# Altium schematic sheet STC32G12K128.SchDoc
size A3; SheetNumber: 1; SheetTotal: 1
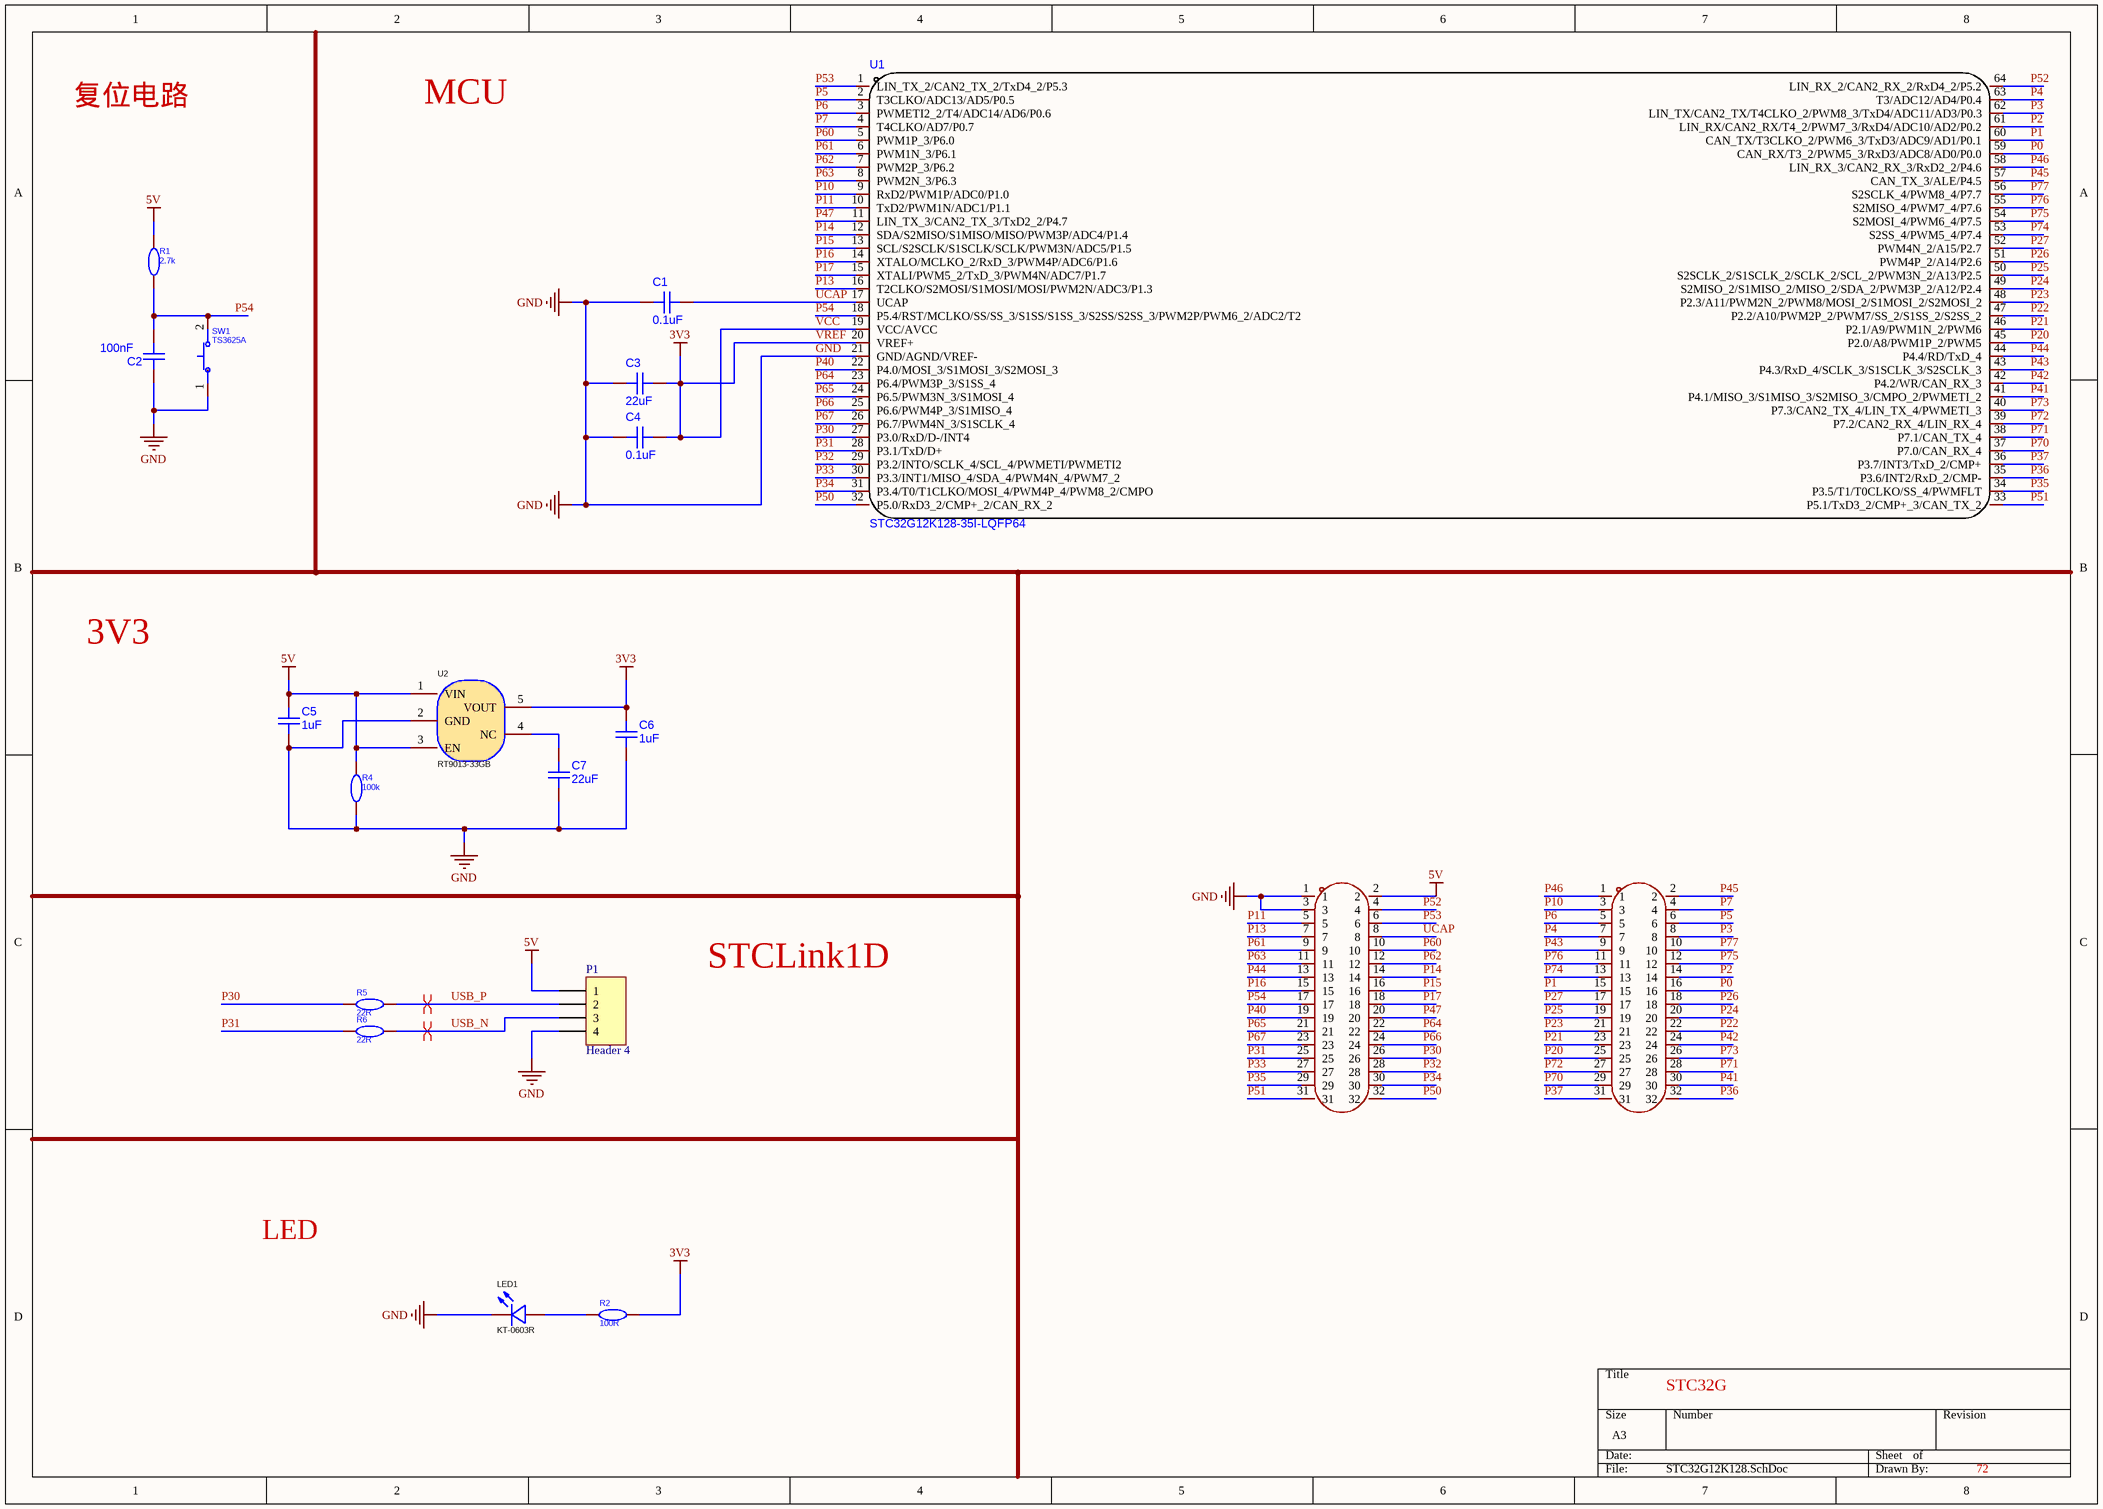
[diagram p0: STC32G12K128.SchDoc]

## Parts
C1  0.1uF  [C0603]
C2  100nF  [C0603]
C3  22uF  [C0603]
C4  0.1uF  [C0603]
C5  1uF  [C0603]
C6  1uF  [C0603]
C7  22uF  [C0603]
H1  X6521WV-2x16H-C60D30  [HDR-TH_32P-2.54-V-M-R2-C16-S2.54]  (value not drawn)
H2  X6521WV-2x16H-C60D30  [HDR-TH_32P-2.54-V-M-R2-C16-S2.54]  (value not drawn)
LED1  KT-0603R  [LED0603-RD]
P1  Header 4  [HDR1X4]
R1  2.7k  [R0603]
R2  100R  [R0603]
R4  100k  [R0603]
R5  22R  [R0603]
R6  22R  [R0603]
SW1  TS3625A  [KEY-SMD_L6.0-W3.5-LS8.4]
U1  STC32G12K128-35I-LQFP64  [LQFP-64_L10.0-W10.0-P0.50-LS12.0-BL]
U2  RT9013-33GB  [SOT-23-5_L3.0-W1.7-P0.95-LS2.8-BL]

## Nets
5V: C5.1 H2.2 P1.1 R1.2 R4.2 U2.1(VIN) U2.3(EN)
GND: C1.2 C2.1 C3.2 C4.2 C5.2 C6.2 C7.2 H2.1 H2.3 LED1.1(K) P1.4 R4.1 SW1.1 U1.21(GND/AGND/VREF-) U2.2(GND)
VCC: C3.1 C4.1 C6.1 R2.1 U1.19(VCC/AVCC) U1.20(VREF+) U2.5(VOUT)  [also labelled 3V3, VREF]
P0: H1.16 U1.59(CAN_RX/T3_2/PWM5_3/RxD3/ADC8/AD0/P0.0)
P1: H1.15 U1.60(CAN_TX/T3CLKO_2/PWM6_3/TxD3/ADC9/AD1/P0.1)
P2: H1.14 U1.61(LIN_RX/CAN2_RX/T4_2/PWM7_3/RxD4/ADC10/AD2/P0.2)
P3: H1.8 U1.62(LIN_TX/CAN2_TX/T4CLKO_2/PWM8_3/TxD4/ADC11/AD3/P0.3)
P4: H1.7 U1.63(T3/ADC12/AD4/P0.4)
P5: H1.6 U1.2(T3CLKO/ADC13/AD5/P0.5)
P6: H1.5 U1.3(PWMETI2_2/T4/ADC14/AD6/P0.6)
P7: H1.4 U1.4(T4CLKO/AD7/P0.7)
P10: H1.3 U1.9(RxD2/PWM1P/ADC0/P1.0)
P11: H2.5 U1.10(TxD2/PWM1N/ADC1/P1.1)
P13: H2.7 U1.16(T2CLKO/S2MOSI/S1MOSI/MOSI/PWM2N/ADC3/P1.3)
P14: H2.14 U1.12(SDA/S2MISO/S1MISO/MISO/PWM3P/ADC4/P1.4)
P15: H2.16 U1.13(SCL/S2SCLK/S1SCLK/SCLK/PWM3N/ADC5/P1.5)
P16: H2.15 U1.14(XTALO/MCLKO_2/RxD_3/PWM4P/ADC6/P1.6)
P17: H2.18 U1.15(XTALI/PWM5_2/TxD_3/PWM4N/ADC7/P1.7)
P20: H1.25 U1.45(P2.0/A8/PWM1P_2/PWM5)
P21: H1.23 U1.46(P2.1/A9/PWM1N_2/PWM6)
P22: H1.22 U1.47(P2.2/A10/PWM2P_2/PWM7/SS_2/S1SS_2/S2SS_2)
P23: H1.21 U1.48(P2.3/A11/PWM2N_2/PWM8/MOSI_2/S1MOSI_2/S2MOSI_2)
P24: H1.20 U1.49(S2MISO_2/S1MISO_2/MISO_2/SDA_2/PWM3P_2/A12/P2.4)
P25: H1.19 U1.50(S2SCLK_2/S1SCLK_2/SCLK_2/SCL_2/PWM3N_2/A13/P2.5)
P26: H1.18 U1.51(PWM4P_2/A14/P2.6)
P27: H1.17 U1.52(PWM4N_2/A15/P2.7)
P30: H2.26 R5.2 U1.27(P3.0/RxD/D-/INT4)
P31: H2.25 R6.2 U1.28(P3.1/TxD/D+)
P32: H2.28 U1.29(P3.2/INTO/SCLK_4/SCL_4/PWMETI/PWMETI2)
P33: H2.27 U1.30(P3.3/INT1/MISO_4/SDA_4/PWM4N_4/PWM7_2)
P34: H2.30 U1.31(P3.4/T0/T1CLKO/MOSI_4/PWM4P_4/PWM8_2/CMPO)
P35: H2.29 U1.34(P3.5/T1/T0CLKO/SS_4/PWMFLT)
P36: H1.32 U1.35(P3.6/INT2/RxD_2/CMP-)
P37: H1.31 U1.36(P3.7/INT3/TxD_2/CMP+)
P40: H2.19 U1.22(P4.0/MOSI_3/S1MOSI_3/S2MOSI_3)
P41: H1.30 U1.41(P4.1/MISO_3/S1MISO_3/S2MISO_3/CMPO_2/PWMETI_2)
P42: H1.24 U1.42(P4.2/WR/CAN_RX_3)
P43: H1.9 U1.43(P4.3/RxD_4/SCLK_3/S1SCLK_3/S2SCLK_3)
P44: H2.13 U1.44(P4.4/RD/TxD_4)
P45: H1.2 U1.57(CAN_TX_3/ALE/P4.5)
P46: H1.1 U1.58(LIN_RX_3/CAN2_RX_3/RxD2_2/P4.6)
P47: H2.20 U1.11(LIN_TX_3/CAN2_TX_3/TxD2_2/P4.7)
P50: H2.32 U1.32(P5.0/RxD3_2/CMP+_2/CAN_RX_2)
P51: H2.31 U1.33(P5.1/TxD3_2/CMP+_3/CAN_TX_2)
P52: H2.4 U1.64(LIN_RX_2/CAN2_RX_2/RxD4_2/P5.2)
P53: H2.6 U1.1(LIN_TX_2/CAN2_TX_2/TxD4_2/P5.3)
P54: C2.2 H2.17 R1.1 SW1.2 U1.18(P5.4/RST/MCLKO/SS/SS_3/S1SS/S1SS_3/S2SS/S2SS_3/PWM2P/PWM6_2/ADC2/T2)
P60: H2.10 U1.5(PWM1P_3/P6.0)
P61: H2.9 U1.6(PWM1N_3/P6.1)
P62: H2.12 U1.7(PWM2P_3/P6.2)
P63: H2.11 U1.8(PWM2N_3/P6.3)
P64: H2.22 U1.23(P6.4/PWM3P_3/S1SS_4)
P65: H2.21 U1.24(P6.5/PWM3N_3/S1MOSI_4)
P66: H2.24 U1.25(P6.6/PWM4P_3/S1MISO_4)
P67: H2.23 U1.26(P6.7/PWM4N_3/S1SCLK_4)
P70: H1.29 U1.37(P7.0/CAN_RX_4)
P71: H1.28 U1.38(P7.1/CAN_TX_4)
P72: H1.27 U1.39(P7.2/CAN2_RX_4/LIN_RX_4)
P73: H1.26 U1.40(P7.3/CAN2_TX_4/LIN_TX_4/PWMETI_3)
P74: H1.13 U1.53(S2SS_4/PWM5_4/P7.4)
P75: H1.12 U1.54(S2MOSI_4/PWM6_4/P7.5)
P76: H1.11 U1.55(S2MISO_4/PWM7_4/P7.6)
P77: H1.10 U1.56(S2SCLK_4/PWM8_4/P7.7)
UCAP: C1.1 H2.8 U1.17(UCAP)
USB_N: P1.3 R6.1
USB_P: P1.2 R5.1
NetC7_1: C7.1 U2.4(NC)
NetLED1_2: LED1.2(A) R2.2

## Layout directives
differential pair: USB_N, USB_P

## Notes on the sheet
- 复位电路
- MCU
- 3V3
- STCLink1D
- LED
- STC32G
- 72

## Library data of the parts
C1 C3-C7 = CC0603KRX7R9BB104: Manufacturer: YAGEO(国巨); Add into BOM: yes; Value: 100nF; Tolerance: ±10%; Voltage Rated: 50V; Temperature Coefficient: X7R; Symbol: CC0603KRX7R9BB104; Device: CC0603KRX7R9BB104; LCSC Part Name: 100nF ±10% 50V; Supplier Part: C14663; Manufacturer Part: CC0603KRX7R9BB104; Supplier Footprint: 0603; JLCPCB Part Class: Basic Part; Datasheet: https://atta.szlcsc.com/upload/public/pdf/source/20180910/C282072_33301C7F631E79921B82A8DAC6BCC5B3.pdf; Supplier: LCSC; Convert to PCB: yes
C2 = CC0603KRX7R9BB104: Manufacturer: YAGEO(国巨); Add into BOM: yes; Tolerance: ±10%; Voltage Rated: 50V; Temperature Coefficient: X7R; Symbol: CC0603KRX7R9BB104; Device: CC0603KRX7R9BB104; LCSC Part Name: 100nF ±10% 50V; Supplier Part: C14663; Manufacturer Part: CC0603KRX7R9BB104; Supplier Footprint: 0603; JLCPCB Part Class: Basic Part; Datasheet: https://atta.szlcsc.com/upload/public/pdf/source/20180910/C282072_33301C7F631E79921B82A8DAC6BCC5B3.pdf; Supplier: LCSC; Convert to PCB: yes; Value: 100nF
H1 H2 = X6521WV-2x16H-C60D30: Manufacturer: XKB Connection(中国星坤); Symbol: X6521WV-2×16H-C30D60; Add into BOM: yes; Pin Structure: 2x16P; Pitch: 2.54mm; Circluar Pins/Square Pins: 方针; Current Rating (Max): 3A; Voltage Rating (Max): 250V; Soldering Temperature(Max): 260℃; Device: X6521WV-2x16H-C60D30; LCSC Part Name: 2x16P 间距:2.54mm 方针; Supplier Part: C725888; Manufacturer Part: X6521WV-2x16H-C60D30; Supplier Footprint: 插件,P=2.54mm; JLCPCB Part Class: Extended Part; Datasheet: https://atta.szlcsc.com/upload/public/pdf/source/20211009/DE33EBA4104B5B447A7BD8383FBBA145.pdf; Supplier: LCSC; Convert to PCB: yes; Row Spacing: 2.54mm; Mounting Type: -; Number of Rows: 双排; Number of Pins: 32P; Length of Mating Pin: -; Insulation Height: 2.5mm; Length of End Connection Pin: -; Contact Material: 黄铜; Contact Plating: 金; Operating Temperature Range: -40℃~+105℃; Color: 黑色
LED1 = KT-0603R: Manufacturer: KENTO; Add into BOM: yes; Emitted Color: 红色; Symbol: KT-0603R; Device: KT-0603R; LCSC Part Name: 0603 红灯 高亮; Supplier Part: C2286; Manufacturer Part: KT-0603R; Supplier Footprint: 0603; JLCPCB Part Class: Basic Part; Datasheet: https://atta.szlcsc.com/upload/public/pdf/source/20160616/1466072038404.pdf; Supplier: LCSC; Convert to PCB: yes; Power Dissipation: -; Forward Current: -; Dominant Wavelength: -; Peak Wavelength: -; Diode Configuration: -; Lens Color: -; Color Temperature: -; Viewing Angle: -; Mounting Sytle: -; Operating Temperature: -40℃~+85℃
P1 = Header 4: Header, 4-Pin; LatestRevisionDate: 17-Jul-2002; LatestRevisionNote: Re-released for DXP Platform.; Publisher: Altium Limited
R1 R2 R4-R6 = RC0603FR-074K7L: Manufacturer: YAGEO(国巨); Add into BOM: yes; Value: 4.7kΩ; Tolerance: ±1%; Power(Watts): 100mW; Overload Voltage (Max): 75V; Temperature Coefficient: ±100ppm/℃; Symbol: RC0603FR-074K7L; Device: RC0603FR-074K7L; LCSC Part Name: 厚膜电阻 4.7kΩ ±1% 100mW; Supplier Part: C99782; Manufacturer Part: RC0603FR-074K7L; Supplier Footprint: 0603; JLCPCB Part Class: Extended Part; Datasheet: https://atta.szlcsc.com/upload/public/pdf/source/20180224/C181757_15194369480721363983.pdf; Supplier: LCSC; Convert to PCB: yes; Type: 厚膜电阻; Operating Temperature Range: -55℃~+155℃
SW1 = TS3625A: Manufacturer: SHOU HAN(首韩); Add into BOM: yes; Circuit: 单刀单掷; Actuator Style: 矩形按钮; Operating Force: 250gf; Switch Length: 6.1mm; Switch Width: 3.65mm; Switch Height: 2.5mm; Contact Current: 50mA; Voltage Rating (DC): 12V; Symbol: TS3625A; Device: TS3625A; LCSC Part Name: 6.1*3.65*2.5mm 立贴 轻触开关; Supplier Part: C398053; Manufacturer Part: TS3625A; Supplier Footprint: SMD; JLCPCB Part Class: Extended Part; Datasheet: https://atta.szlcsc.com/upload/public/pdf/source/20190620/C398053_EFFFB524A3F966B1F45EE8333D1EDECC.pdf; Supplier: LCSC; Convert to PCB: yes; Mounting Style: 立贴; With Lamp: -; Mechanical Life: -
U1 = STC32G12K128-35I-LQFP64: Manufacturer: STC(宏晶); Add into BOM: yes; Symbol: STC32G12K128-35I-LQFP64; Device: STC32G12K128-35I-LQFP64; LCSC Part Name: STC32G12K128-35I-LQFP64; Supplier Part: C5210761; Manufacturer Part: STC32G12K128-35I-LQFP64; Supplier Footprint: LQFP-64; JLCPCB Part Class: Extended Part; Datasheet: https://atta.szlcsc.com/upload/public/pdf/source/20230914/AA8E7D278420EC7FE3821FDFD9AB7FC5.pdf; Supplier: LCSC; Convert to PCB: yes
U2 = RT9013-33GB: Manufacturer: RICHTEK(立锜); Add into BOM: yes; Output Type: 固定; Maximum Input Voltage: 5.5V; Output Voltage: 3.3V; MAX Output Current: 500mA; Power Supply Rejection Ratio (PSRR): 50dB@(10kHz); Dropout Voltage: 400mV@(500mA); standby current: 50uA; Output Polarity: 正极; Number of Outputs: 1; Symbol: RT9013-33GB; Device: RT9013-33GB; LCSC Part Name: 输入5.5V 输出3.3V 500mA; Supplier Part: C47773; Manufacturer Part: RT9013-33GB; Supplier Footprint: SOT-23-5; JLCPCB Part Class: Extended Part; Datasheet: https://atta.szlcsc.com/upload/public/pdf/source/20150504/1457707282459.pdf; Supplier: LCSC; Convert to PCB: yes; Noise: -; Feature: -; Operating Temperature: -40℃~+85℃